# EAGLE design InterfaceBoard (EAGLE 9.6.2)
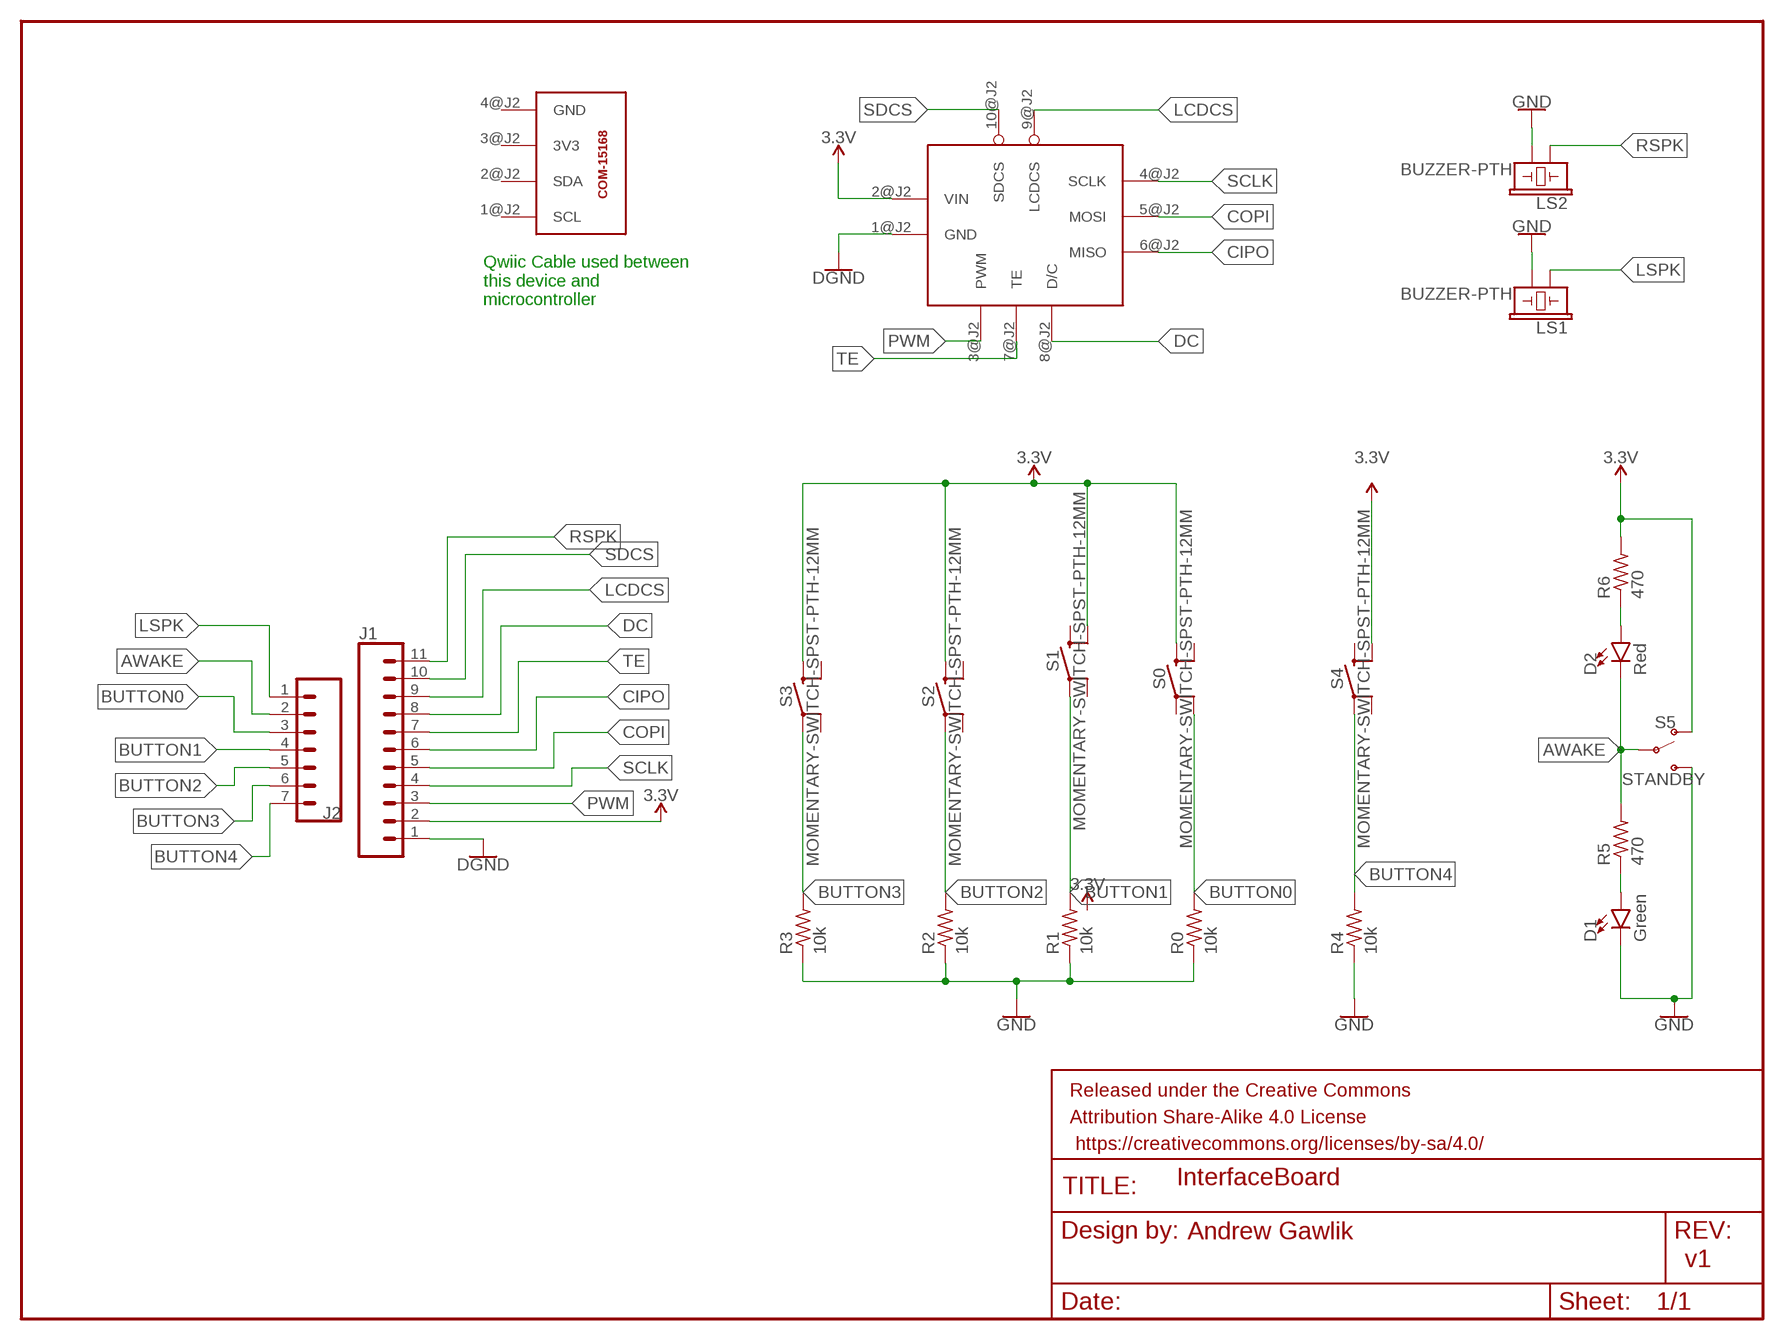
[diagram p0: schematic, sheet 1]

## Parts
A2  TFT  LCD-15143  [LCD-15143]
A3  COM-15168  [COM-15168]
D1  Green  LED5MM-KIT  [LED_5MM-KIT]
D2  Red  LED5MM-KIT  [LED_5MM-KIT]
FRAME1  FRAME-LETTER  [CREATIVE_COMMONS]
J1  CONN_11LOCK  [1X11_LOCK]
J2  CONN_07LOCK  [1X07_LOCK]
LS1  BUZZER-PTH  [BUZZER-12MM]
LS2  BUZZER-PTH  [BUZZER-12MM]
R0  10k  R-US_0204/5  [0204/5]
R1  10k  R-US_0204/5  [0204/5]
R2  10k  R-US_0204/5  [0204/5]
R3  10k  R-US_0204/5  [0204/5]
R4  10k  R-US_0204/5  [0204/5]
R5  470  R-US_0204/5  [0204/5]
R6  470  R-US_0204/5  [0204/5]
S0  MOMENTARY-SWITCH-SPST-PTH-12MM  [TACTILE_SWITCH_PTH_12MM]
S1  MOMENTARY-SWITCH-SPST-PTH-12MM  [TACTILE_SWITCH_PTH_12MM]
S2  MOMENTARY-SWITCH-SPST-PTH-12MM  [TACTILE_SWITCH_PTH_12MM]
S3  MOMENTARY-SWITCH-SPST-PTH-12MM  [TACTILE_SWITCH_PTH_12MM]
S4  MOMENTARY-SWITCH-SPST-PTH-12MM  [TACTILE_SWITCH_PTH_12MM]
S5  STANDBY  SWITCH-SPDT-PTH-11.6X4.0MM  [SWITCH_SPDT_PTH_11.6X4.0MM]

## Nets
3.3V: A2.2@J2(VIN) J1.2 R6.2 S0.3 S1.4 S2.3 S3.3 S4.4 S5.1(O)
AWAKE: D2.K(C) J2.2 R5.2 S5.2(P)
BUTTON0: J2.3 R0.2 S0.2
BUTTON1: J2.4 R1.2 S1.1
BUTTON2: J2.5 R2.2 S2.1
BUTTON3: J2.6 R3.2 S3.1
BUTTON4: J2.7 R4.2 S4.1
CIPO: A2.6@J2(MISO) J1.6
COPI: A2.5@J2(MOSI) J1.5
DC: A2.8@J2(D/C) J1.8
GND: A2.1@J2(GND) D1.K(C) J1.1 LS1.- LS2.- R0.1 R1.1 R2.1 R3.1 R4.1 S5.3(S) ; supply symbol labelled DGND
LCDCS: A2.9@J2(LCDCS) J1.9
LSPK: J2.1 LS1.+
N$2: D1.A R5.1
N$4: D2.A R6.1
PWM: A2.3@J2(PWM) J1.3
RSPK: J1.11 LS2.+
SCLK: A2.4@J2(SCLK) J1.4
SDCS: A2.10@J2(SDCS) J1.10
TE: A2.7@J2(TE) J1.7
Unconnected: A3.1@J2(SCL) A3.2@J2(SDA) A3.3@J2(3V3) A3.4@J2(GND) S0.1 S0.4 S1.2 S1.3 S2.2 S2.4 S3.2 S3.4 S4.2 S4.3

## Notes on the sheet
- Qwiic Cable used between
  this device and
  microcontroller
- Andrew Gawlik
- v1

## Library data of the parts
A2 = SparkFunBreakouts:LCD-15143: SparkFun TFT LCD Breakout - 1.8" (128x160) The SparkFun TFT LCD Breakout is a versatile, colorful, and easy way to experiment with graphics or create a user interface for your project. With a 4-wire SPI interface and microSD card holder, you can use this breakout to easily add visual display/interface capabilities to a project as well as providing all the storage you might need for multimedia files. To get started with this breakout, you will need an Arduino compatible microcontroller of your choice - we recommend something with extra RAM like the SparkFun Thing Plus <https://www.sparkfun.com/products/14689>. The breakout can be powered with either 5V or 3.3V. The microSD card holder is connected to the same SPI bus as the display which keeps the required pin count low and exists to relieve the burden from your microcontroller's poor memory due to having to store hundreds of images of cats, or really whatever you want to keep there. We have also gone ahead and tricked out the SparkFun HyperDisplay library <https://learn.sparkfun.com/tutorials/everything-you-should-know-about-hyperdisplay?_ga=2.57664686.500067859.1617115070-1450422450.1611246352> with a driver made especially for this breakout! Out of the box, the SparkFun TFT LCD Breakout will come with a large backing PCB that makes it easy to securely mount the display in a project. If you need a more flexible solution you can remove the display module, snap off half the backing board, and then re-insert the display module. When this is done you'll be left with the bare minimum frame around the display to more seamlessly integrate with your project.
A3 = SparkFunBreakouts:COM-15168: SparkFun Qwiic Joystick Now, you can easily add an HID/controller to your project! The SparkFun Qwiic Joystick combines the convenience of the Qwiic connection system and an analog joystick that feels reminiscent of the thumbstick from a PlayStation 2 controller and for that reason it's become a favorite of ours. The only thing that could make it better is a "smart" version, so we made one! With the pre-installed firmware, the ATtiny85 is acts as an intermediary (microcontroller) for the analog and digital inputs from the joystick. This allows the Qwiic Joystick to report its position over I2C. Utilizing our handy Qwiic system, no soldering is required to connect it to the rest of your system. However, we still have broken out 0.1"-spaced pins in case you prefer to use a breadboard. The joystick is similar to the analog joysticks on PS2 (PlayStation 2) controllers. Directional movements are simply measured with two 10 kΩ potentiometers, connected with a gimbal mechanism that separates the horizontal and vertical movements. This joystick also has a select button that is actuated when the joystick is pressed down. The SparkFun Qwiic Joystick's I2C address is also software selectable so you can plenty of them to the same bus without any risk of collision! NOTE: The I2C address of the Qwiic Joystick is 0x20 and is software configurable. A multiplexer/Mux is required to communicate to multiple Qwiic Joystick sensors on a single bus. If you need to use more than one Qwiic Joystick sensor consider using the Qwiic Mux Breakout <https://www.sparkfun.com/products/16784>. The SparkFun Qwiic Connect System is an ecosystem of I2C sensors, actuators, shields and cables that make prototyping faster and less prone to error. All Qwiic-enabled boards use a common 1mm pitch, 4-pin JST connector. This reduces the amount of required PCB space, and polarized connections mean you can’t hook it up wrong.
D1 D2 = SparkFun-LED:LED: LED (Generic) Standard schematic elements and footprints for 5mm, 3mm, 1206, and 0603 sized LEDs. Generic LEDs with no color specified.
FRAME1 = SparkFun-Aesthetics:FRAME-LETTER: Schematic Frame - Letter Standard 8.5x11 US Letter frame
J1 = SparkFun-Connectors:CONN_11: Multi connection point. Often used as Generic Header-pin footprint for 0.1 inch spaced/style header connections On any of the 0.1 inch spaced packages, you can populate with these: Break Away Headers - Straight <https://www.sparkfun.com/products/116> (PRT-00116) Break Away Male Headers - Right Angle <https://www.sparkfun.com/products/553> (PRT-00553) Female Headers <https://www.sparkfun.com/products/115> (PRT-00115) Break Away Headers - Machine Pin <https://www.sparkfun.com/products/117> (PRT-00117) Break Away Female Headers - Swiss Machine Pin <https://www.sparkfun.com/products/743> (PRT-00743) For SCREWTERMINALS and SPRING TERMINALS visit here: Screw Terimnals on SparkFun.com <https://www.sparkfun.com/search/results?term=Screw+Terminals> (5mm/3.5mm/2.54mm spacing) This device is also useful as a general connection point to wire up your design to another part of your project. Our various solder wires solder well into these plated through hole pads. Hook-Up Wire - Assortment (Stranded, 22 AWG) <https://www.sparkfun.com/products/11375> (PRT-11375) Hook-Up Wire - Assortment (Solid Core, 22 AWG) <https://www.sparkfun.com/products/11367> (PRT-11367) View the entire wire category on our website here <https://www.sparkfun.com/categories/141>
J2 = SparkFun-Connectors:CONN_07: Multi connection point. Often used as Generic Header-pin footprint for 0.1 inch spaced/style header connections On any of the 0.1 inch spaced packages, you can populate with these: Break Away Headers - Straight <https://www.sparkfun.com/products/116> (PRT-00116) Break Away Male Headers - Right Angle <https://www.sparkfun.com/products/553> (PRT-00553) Female Headers <https://www.sparkfun.com/products/115> (PRT-00115) Break Away Headers - Machine Pin <https://www.sparkfun.com/products/117> (PRT-00117) Break Away Female Headers - Swiss Machine Pin <https://www.sparkfun.com/products/743> (PRT-00743) For SCREWTERMINALS and SPRING TERMINALS visit here: Screw Terimnals on SparkFun.com <https://www.sparkfun.com/search/results?term=Screw+Terminals> (5mm/3.5mm/2.54mm spacing) This device is also useful as a general connection point to wire up your design to another part of your project. Our various solder wires solder well into these plated through hole pads. Hook-Up Wire - Assortment (Stranded, 22 AWG) <https://www.sparkfun.com/products/11375> (PRT-11375) Hook-Up Wire - Assortment (Solid Core, 22 AWG) <https://www.sparkfun.com/products/11367> (PRT-11367) View the entire wire category on our website here <https://www.sparkfun.com/categories/141> Special notes: Molex polarized connector foot print use with SKU : PRT-08231 with associated crimp pins and housings. 1MM SMD Version SKU: PRT-10208 NOTES ON THE VARIANTS LOCK and LOCK_LONGPADS... This footprint was designed to help hold the alignment of a through-hole component (i.e. 6-pin header) while soldering it into place. You may notice that each hole has been shifted either up or down by 0.005 of an inch from it's more standard position (which is a perfectly straight line). This slight alteration caused the pins (the squares in the middle) to touch the edges of the holes. Because they are alternating, it causes a "brace" to hold the component in place. 0.005 has proven to be the perfect amount of "off-center" position when using our standard breakaway headers. Although looks a little odd when you look at the bare footprint, once you have a header in there, the alteration is very hard to notice. Also,if you push a header all the way into place, it is covered up entirely on the bottom side.
LS1 LS2 = SparkFun-Electromechanical:BUZZER: Buzzer Small round buzzers that operate around the audible 2kHz range. You can use these as speakers to create simple music or user interfaces. Variant Overview: PTH - Mini Speaker - PC Mount 12mm 2.048kHz <https://www.sparkfun.com/products/7950> PTH_KIT - Mini Speaker - PC Mount 12mm 2.048kHz <https://www.sparkfun.com/products/7950> KIT simplifies soldering by adding stop mask to one side of the pads. PTH_NO_SILK - Mini Speaker - PC Mount 12mm 2.048kHz <https://www.sparkfun.com/products/7950> No silkscreen indicator of buzzer outline. PTH_KIT_NO_SILK - Mini Speaker - PC Mount 12mm 2.048kHz <https://www.sparkfun.com/products/7950> KIT package w/o silkscreen SMD - Buzzer Audio Magnetic (CCV-084B16) SMD buzzer used on, e.g. the LilyPad Buzzer <https://www.sparkfun.com/products/8463> and RFID USB Reader <https://www.sparkfun.com/products/9963>. SMD_KIT - Buzzer Audio Magnetic (CCV-084B16) SMD Buzzer with elongated pins to make soldering easier. Used on the SparkFun Simon Says - Surface Mount Soldering Kit <https://www.sparkfun.com/products/10935>.; PROD_ID: COMP-08253; SF_SKU: COM-07950
R0 R1-R6 = rcl:R-US_: RESISTOR, American symbol; SPICEPREFIX: R
S0 S1-S4 = SparkFun-Switches:MOMENTARY-SWITCH-SPST: Momentary Switch (Pushbutton) - SPST Normally-open (NO) SPST momentary switches (buttons, pushbuttons). Variants PTH-12MM - 12mm square, through-hole Momentary Pushbutton Switch - 12mm Square <https://www.sparkfun.com/products/9190> (COM-09190) PTH-6.0MM, PTH-6.0MM-KIT - 6.0mm square, through-hole Mini Pushbutton Switch <https://www.sparkfun.com/products/97> (COM-00097) KIT package intended for soldering kit's - only one side of pads' copper is exposed. PTH-RIGHT-ANGLE-KIT - Right-angle, through-hole Right Angle Tactile Button <https://www.sparkfun.com/products/10791> - Used on SparkFun BigTime Watch Kit <https://www.sparkfun.com/products/11734> SMD-12MM - 12mm square, surface-mount Tactile Button - SMD (12mm) <https://www.sparkfun.com/products/12993> (COM-12993) Used on SparkFun PicoBoard <https://www.sparkfun.com/products/11888> SMD-4.5MM - 4.5mm Square Trackball Switch Used on SparkFun Blackberry Trackballer Breakout <https://www.sparkfun.com/products/13169> SMD-4.6MMX2.8MM - 4.60mm x 2.80mm, surface mount Used on SparkFun SAMD21 Mini Breakout <https://www.sparkfun.com/products/13664> SMD-5.2MM, SMD-5.2-REDUNDANT - 5.2mm square, surface-mount Mini Pushbutton Switch - SMD <https://www.sparkfun.com/products/8720> (COM-08720) Used on Arduino Pro Mini <https://www.sparkfun.com/products/11114> REDUNDANT package connects both switch circuits together SMD-6.0X3.5MM - 6.0 x 3.5mm, surface mount Momentary Reset Switch SMD <https://www.sparkfun.com/products/8229> (COM-08229) SMD-6.2MM-TALL - 6.2mm square, surface mount Tactile Button - SMD (6mm) <https://www.sparkfun.com/products/12992> Used on SparkFun Digital Sandbox <https://www.sparkfun.com/products/12651> SMD-RIGHT-ANGLE - Right-angle, surface mount Used on SparkFun Block for Intel® Edison - Arduino <https://www.sparkfun.com/products/13036>; PROD_ID: SWCH-09185; SF_SKU: COM-09190
S5 = SparkFun-Switches:SWITCH-SPDT: Single Pole, Double Throw (SPDT) Switch Single-pole, double-throw (SPDT) switch. Variant Overview SMD-AYZ0202 Surface Mount DPDT Switch <https://www.sparkfun.com/products/597> (COM-00597) Used on e.g. LilyPad Arduino USB - ATmega32U4 Board <https://www.sparkfun.com/products/12049> PTH-11.6X4.0MM SPDT Mini Power Switch <https://www.sparkfun.com/products/102> (COM-00102) Used on e.g. SparkFun Simon Says - Through-Hole Soldering Kit <https://www.sparkfun.com/products/10547> (KIT-10547) PTH-11.6X4.0MM-KIT KIT version of SPDT Mini Power Switch - Simplifies soldering by removing tStop of switch pins - only one side can be soldered. PTH-11.6X4.0MM-LOCK LOCK version of SPDT Mini Power Switch - Offset pins hold switch in place for easier soldering. SMD-RIGHT-ANGLE Surface Mount Right Angle Switch <https://www.sparkfun.com/products/10860> (COM-10860) Used on e.g. SparkFun ESP8266 Thing <https://www.sparkfun.com/products/13231>; PROD_ID: SWCH-08261; SF_SKU: COM-00102

## Board
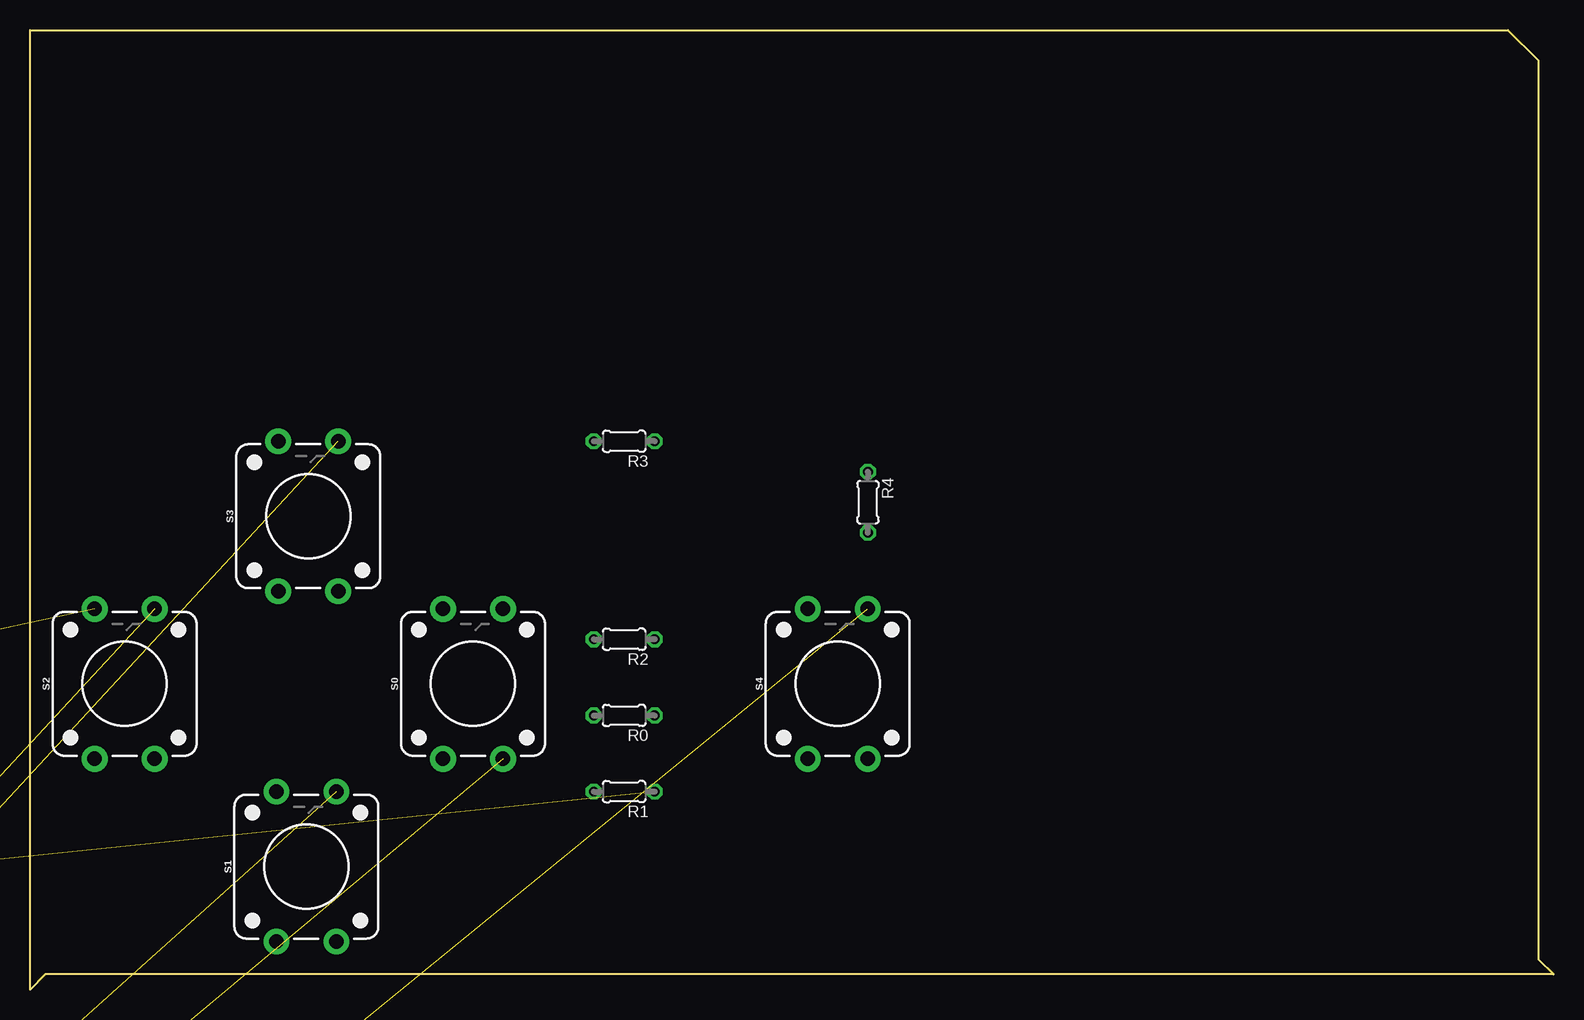
[diagram p1: board, top side]
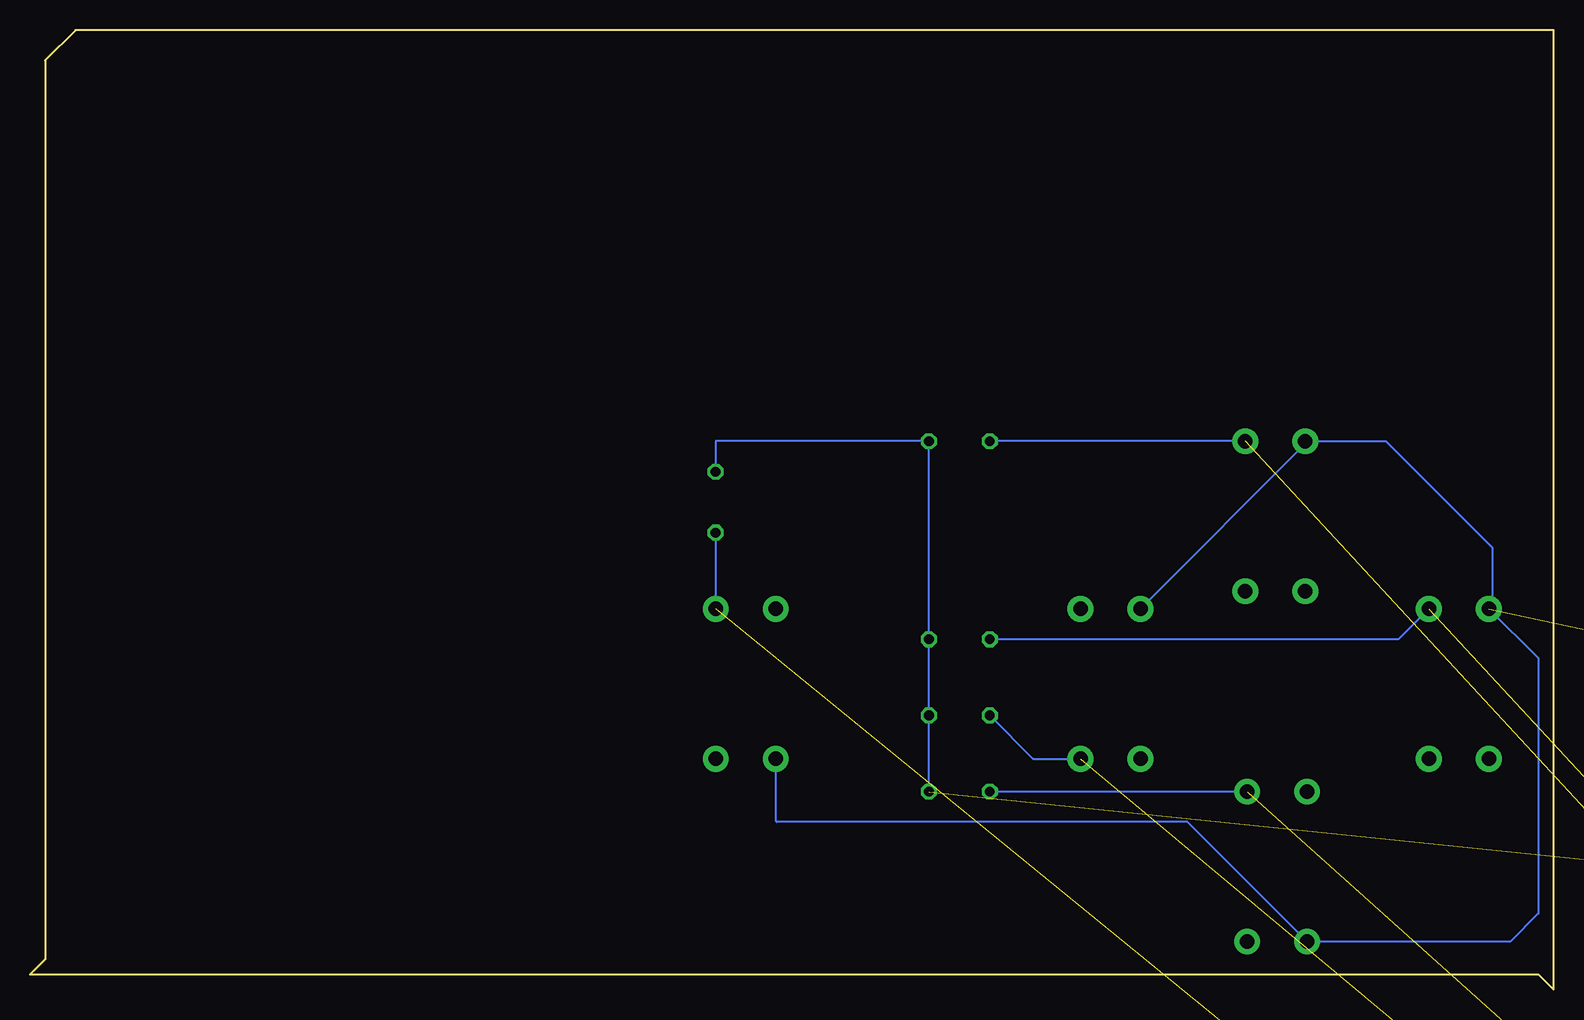
[diagram p2: board, bottom side, seen from below]

Size 127 x 80.01 mm. Coordinates in mm from the lower left corner, seen from the top.
Outline: 0,0 0,80.01 123.19,80.01 125.73,77.47 125.73,2.54 127,1.27 1.27,1.27 0,0
Copper layers (1*16): Top 0.035mm / dielectric 1.5mm / Bottom 0.035mm
Design rules "default": minimum track width 6mil, minimum drill 0.35mm, track to track 6mil, track to pad 6mil, pad to pad 6mil, via to via 6mil, smd to smd 6mil, copper to edge 40mil, drill to drill 6mil, minimum pad ring 10mil, minimum via ring 8mil, stop-mask expansion 4mil, vias tented up to drill 0mil, thermal gap 10mil

### Footprints (pad centres in the part's own frame; a part is rotated, then mirrored left to right if it is on the bottom)
LCD-15143 = drill 1.016 pad 1.88: 1@J2 7.62,1.27; 2@J2 10.16,1.27; 3@J2 12.7,1.27; 4@J2 15.24,1.27; 5@J2 17.78,1.27; 6@J2 20.32,1.27; 7@J2 22.86,1.27; 8@J2 25.4,1.27; 9@J2 27.94,1.27; 10@J2 30.48,1.27 | hole 3.302: 3.175,3.175; 3.175,56.515; 34.925,3.175; 34.925,56.515 | hole 1.27: 2.945,52.49; 2.945,7.19; 35.345,7.19
COM-15168 = drill 1.016 pad 1.88: 1@J2 16.51,49.53; 2@J2 13.97,49.53; 3@J2 11.43,49.53; 4@J2 8.89,49.53 | hole 3.302: 22.86,48.26; 2.54,48.26; 2.54,2.54; 22.86,2.54
LED_5MM-KIT = drill 0.813 pad 1.88: A -1.27,0; K 1.27,0
1X11_LOCK = drill 1.016 pad 1.88: 1 0,0.127; 2 2.54,-0.127; 3 5.08,0.127; 4 7.62,-0.127; 5 10.16,0.127; 6 12.7,-0.127; 7 15.24,0.127; 8 17.78,-0.127; 9 20.32,0.127; 10 22.86,-0.127; 11 25.4,0.127
1X07_LOCK = drill 1.016 pad 1.88: 1 0,0.127; 2 2.54,-0.127; 3 5.08,0.127; 4 7.62,-0.127; 5 10.16,0.127; 6 12.7,-0.127; 7 15.24,0.127
BUZZER-12MM = drill 0.9 pad 1.778: + 3.25,0; - -3.25,0
0204/5 = drill 0.813 octagon: 1 -2.54,0; 2 2.54,0
TACTILE_SWITCH_PTH_12MM = drill 1.2 pad 2.159: 1 6.25,-2.5; 2 -6.25,-2.5; 3 6.25,2.5; 4 -6.25,2.5
SWITCH_SPDT_PTH_11.6X4.0MM = drill 1.016 pad 1.88: 1 0,2.54; 2 0,0; 3 0,-2.54

### Placement (x,y rotation side)
A2  -168.91,-90.17 0 top  (outside the outline)
A3  -168.91,-142.24 0 top  (outside the outline)
D1  -158.75,-5.08 0 top  (outside the outline)
D2  -166.37,-19.05 0 top  (outside the outline)
FRAME1  -149.18,1.27 0 top  (outside the outline)
J1  -167.64,-146.05 0 top  (outside the outline)
J2  -167.64,-149.86 0 top  (outside the outline)
LS1  -137.16,-99.06 0 top  (outside the outline)
LS2  -124.46,-99.06 0 top  (outside the outline)
R0  49.53,22.86 180 top
R1  49.53,16.51 180 top
R2  49.53,29.21 180 top
R3  49.53,45.72 180 top
R4  69.85,40.64 270 top
R5  -160.02,-16.51 0 top  (outside the outline)
R6  -166.37,-26.67 0 top  (outside the outline)
S0  36.93,25.5 90 top
S1  23.04,10.26 90 top
S2  7.88,25.5 90 top
S3  23.2,39.47 90 top
S4  67.33,25.5 90 top
S5  -166.37,-7.62 0 top  (outside the outline)

### Tracks (layer width: path | path; a pad name or v marks a point on that pad's centre or on a via)
3.3V  (4 unrouted)
  Bottom 0.152: S3.3 20.46,45.72 | 20.46,45.72 13.97,45.72 5.08,36.83 5.08,32.05 S2.3 1.27,27.64 1.27,6.35 3.61,4.01 S1.4 30.5,13.97 64.77,13.97 64.83,14.03 S4.4 | S0.3 20.46,45.72
AWAKE  (3 unrouted)
BUTTON0  (1 unrouted)
  Bottom 0.152: R0.2 43.38,19.25 S0.2
BUTTON1  (1 unrouted)
  Bottom 0.152: S1.1 R1.2
BUTTON2  (1 unrouted)
  Bottom 0.152: S2.1 12.92,29.21 R2.2
BUTTON3  (1 unrouted)
  Bottom 0.152: S3.1 R3.2
BUTTON4  (1 unrouted)
  Bottom 0.152: R4.2 69.85,31.77 S4.1
CIPO  (1 unrouted)
COPI  (1 unrouted)
DC  (1 unrouted)
GND  (6 unrouted)
  Bottom 0.152: R1.1 R0.1 R2.1 R3.1 69.85,45.72 R4.1
LCDCS  (1 unrouted)
LSPK  (1 unrouted)
N$2  (1 unrouted)
N$4  (1 unrouted)
PWM  (1 unrouted)
RSPK  (1 unrouted)
SCLK  (1 unrouted)
SDCS  (1 unrouted)
TE  (1 unrouted)

### Text on the board
Document: Andrew Gawlik